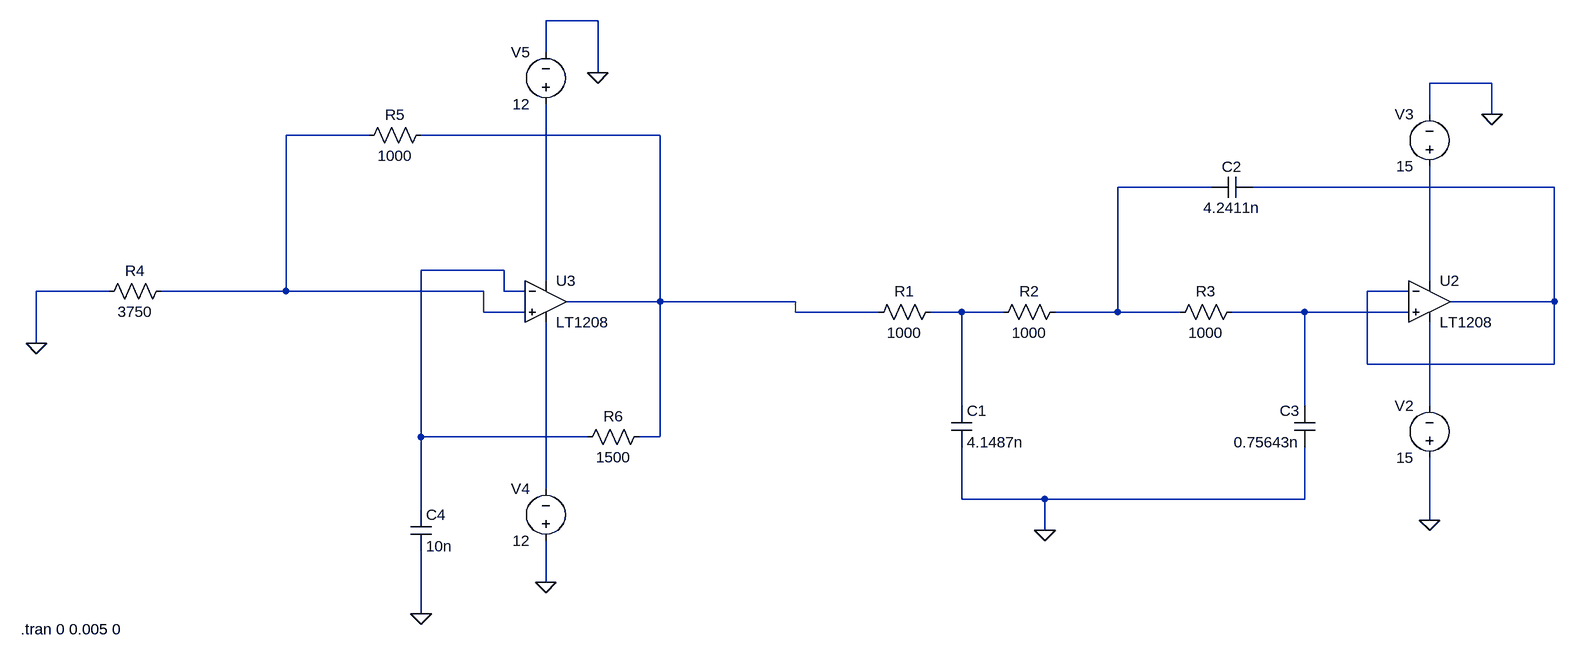
[diagram p0: schematic filtro.asc]
filtro.asc, the LTspice schematic file:
Version 4
SHEET 1 1236 680
WIRE -416 -288 -496 -288
WIRE -496 -240 -496 -288
WIRE -416 -208 -416 -288
WIRE 960 -192 864 -192
WIRE 864 -144 864 -192
WIRE 960 -144 960 -192
WIRE -768 -112 -896 -112
WIRE -320 -112 -688 -112
WIRE 528 -32 384 -32
WIRE 1056 -32 592 -32
WIRE -560 96 -688 96
WIRE -496 112 -496 -160
WIRE 864 112 864 -64
WIRE -1168 128 -1280 128
WIRE -896 128 -896 -112
WIRE -896 128 -1088 128
WIRE -592 128 -896 128
WIRE -560 128 -560 96
WIRE -528 128 -560 128
WIRE 832 128 768 128
WIRE -320 144 -320 -112
WIRE -320 144 -464 144
WIRE -112 144 -320 144
WIRE 1056 144 1056 -32
WIRE 1056 144 896 144
WIRE -592 160 -592 128
WIRE -528 160 -592 160
WIRE -112 160 -112 144
WIRE 16 160 -112 160
WIRE 144 160 96 160
WIRE 208 160 144 160
WIRE 384 160 384 -32
WIRE 384 160 288 160
WIRE 480 160 384 160
WIRE 672 160 560 160
WIRE 832 160 672 160
WIRE -1280 208 -1280 128
WIRE 768 240 768 128
WIRE 1056 240 1056 144
WIRE 1056 240 768 240
WIRE 144 304 144 160
WIRE 672 304 672 160
WIRE 864 304 864 176
WIRE -688 352 -688 96
WIRE -432 352 -688 352
WIRE -320 352 -320 144
WIRE -320 352 -352 352
WIRE -496 432 -496 176
WIRE 144 448 144 368
WIRE 272 448 144 448
WIRE 672 448 672 368
WIRE 672 448 272 448
WIRE -688 464 -688 352
WIRE 864 480 864 384
WIRE 272 496 272 448
WIRE -496 576 -496 512
WIRE -688 624 -688 528
FLAG 272 496 0
FLAG 960 -144 0
FLAG 864 480 0
FLAG -1280 208 0
FLAG -688 624 0
FLAG -416 -208 0
FLAG -496 576 0
DATAFLAG 288 160 ""
DATAFLAG -1200 128 ""
DATAFLAG -960 128 ""
DATAFLAG -608 -112 ""
DATAFLAG 1056 144 ""
SYMBOL res 112 144 R90
WINDOW 0 0 56 VBottom 2
WINDOW 3 32 56 VTop 2
SYMATTR InstName R1
SYMATTR Value 1000
SYMATTR SpiceLine tol=1 pwr=1
SYMBOL res 304 144 R90
WINDOW 0 0 56 VBottom 2
WINDOW 3 32 56 VTop 2
SYMATTR InstName R2
SYMATTR Value 1000
SYMBOL res 576 144 R90
WINDOW 0 0 56 VBottom 2
WINDOW 3 32 56 VTop 2
SYMATTR InstName R3
SYMATTR Value 1000
SYMBOL cap 128 304 R0
SYMATTR InstName C1
SYMATTR Value 4.1487n
SYMBOL cap 592 -48 R90
WINDOW 0 0 32 VBottom 2
WINDOW 3 32 32 VTop 2
SYMATTR InstName C2
SYMATTR Value 4.2411n
SYMBOL cap 688 368 R180
WINDOW 0 24 56 Left 2
WINDOW 3 24 8 Left 2
SYMATTR InstName C3
SYMATTR Value 0.75643n
SYMBOL voltage 864 400 R180
WINDOW 0 24 96 Left 2
WINDOW 3 24 16 Left 2
WINDOW 123 0 0 Left 0
WINDOW 39 0 0 Left 0
SYMATTR InstName V2
SYMATTR Value 15
SYMBOL voltage 864 -48 R180
WINDOW 0 24 96 Left 2
WINDOW 3 24 16 Left 2
WINDOW 123 0 0 Left 0
WINDOW 39 0 0 Left 0
SYMATTR InstName V3
SYMATTR Value 15
SYMBOL res -1072 112 R90
WINDOW 0 0 56 VBottom 2
WINDOW 3 32 56 VTop 2
SYMATTR InstName R4
SYMATTR Value 3750
SYMBOL res -672 -128 R90
WINDOW 0 0 56 VBottom 2
WINDOW 3 32 56 VTop 2
SYMATTR InstName R5
SYMATTR Value 1000
SYMBOL res -336 336 R90
WINDOW 0 0 56 VBottom 2
WINDOW 3 32 56 VTop 2
SYMATTR InstName R6
SYMATTR Value 1500
SYMBOL cap -704 464 R0
SYMATTR InstName C4
SYMATTR Value 10n
SYMBOL voltage -496 528 R180
WINDOW 0 24 96 Left 2
WINDOW 3 24 16 Left 2
WINDOW 123 0 0 Left 0
WINDOW 39 0 0 Left 0
SYMATTR InstName V4
SYMATTR Value 12
SYMBOL voltage -496 -144 R180
WINDOW 0 24 96 Left 2
WINDOW 3 24 16 Left 2
WINDOW 123 0 0 Left 0
WINDOW 39 0 0 Left 0
SYMATTR InstName V5
SYMATTR Value 12
SYMBOL OpAmps\\LT1208 -496 80 R0
SYMATTR InstName U3
SYMBOL OpAmps\\LT1208 864 80 R0
SYMATTR InstName U2
TEXT -1304 648 Left 2 !.tran 0 0.005 0

The netlist it stands for:
* filtro.asc
R1 N008 N002 1000 tol=1 pwr=1
R2 N003 N008 1000
R3 N009 N003 1000
C1 N008 0 4.1487n
C2 N004 N003 4.2411n
C3 0 N009 0.75643n
V2 0 N010 15
V3 N007 0 15
R4 N001 0 3750
R5 N002 N001 1000
R6 N002 N005 1500
C4 N005 0 10n
V4 0 N011 12
V5 N006 0 12
XU3 N001 N005 N006 N011 N002 LT1208  ; pins In+ In- V+ V- OUT
XU2 N009 N004 N007 N010 N004 LT1208  ; pins In+ In- V+ V- OUT
.tran 0 0.005 0
.backanno
.end